# EAGLE design mapleCUx_large_330-014 (EAGLE 7.7.0)
MAPLE-CUx Large Version
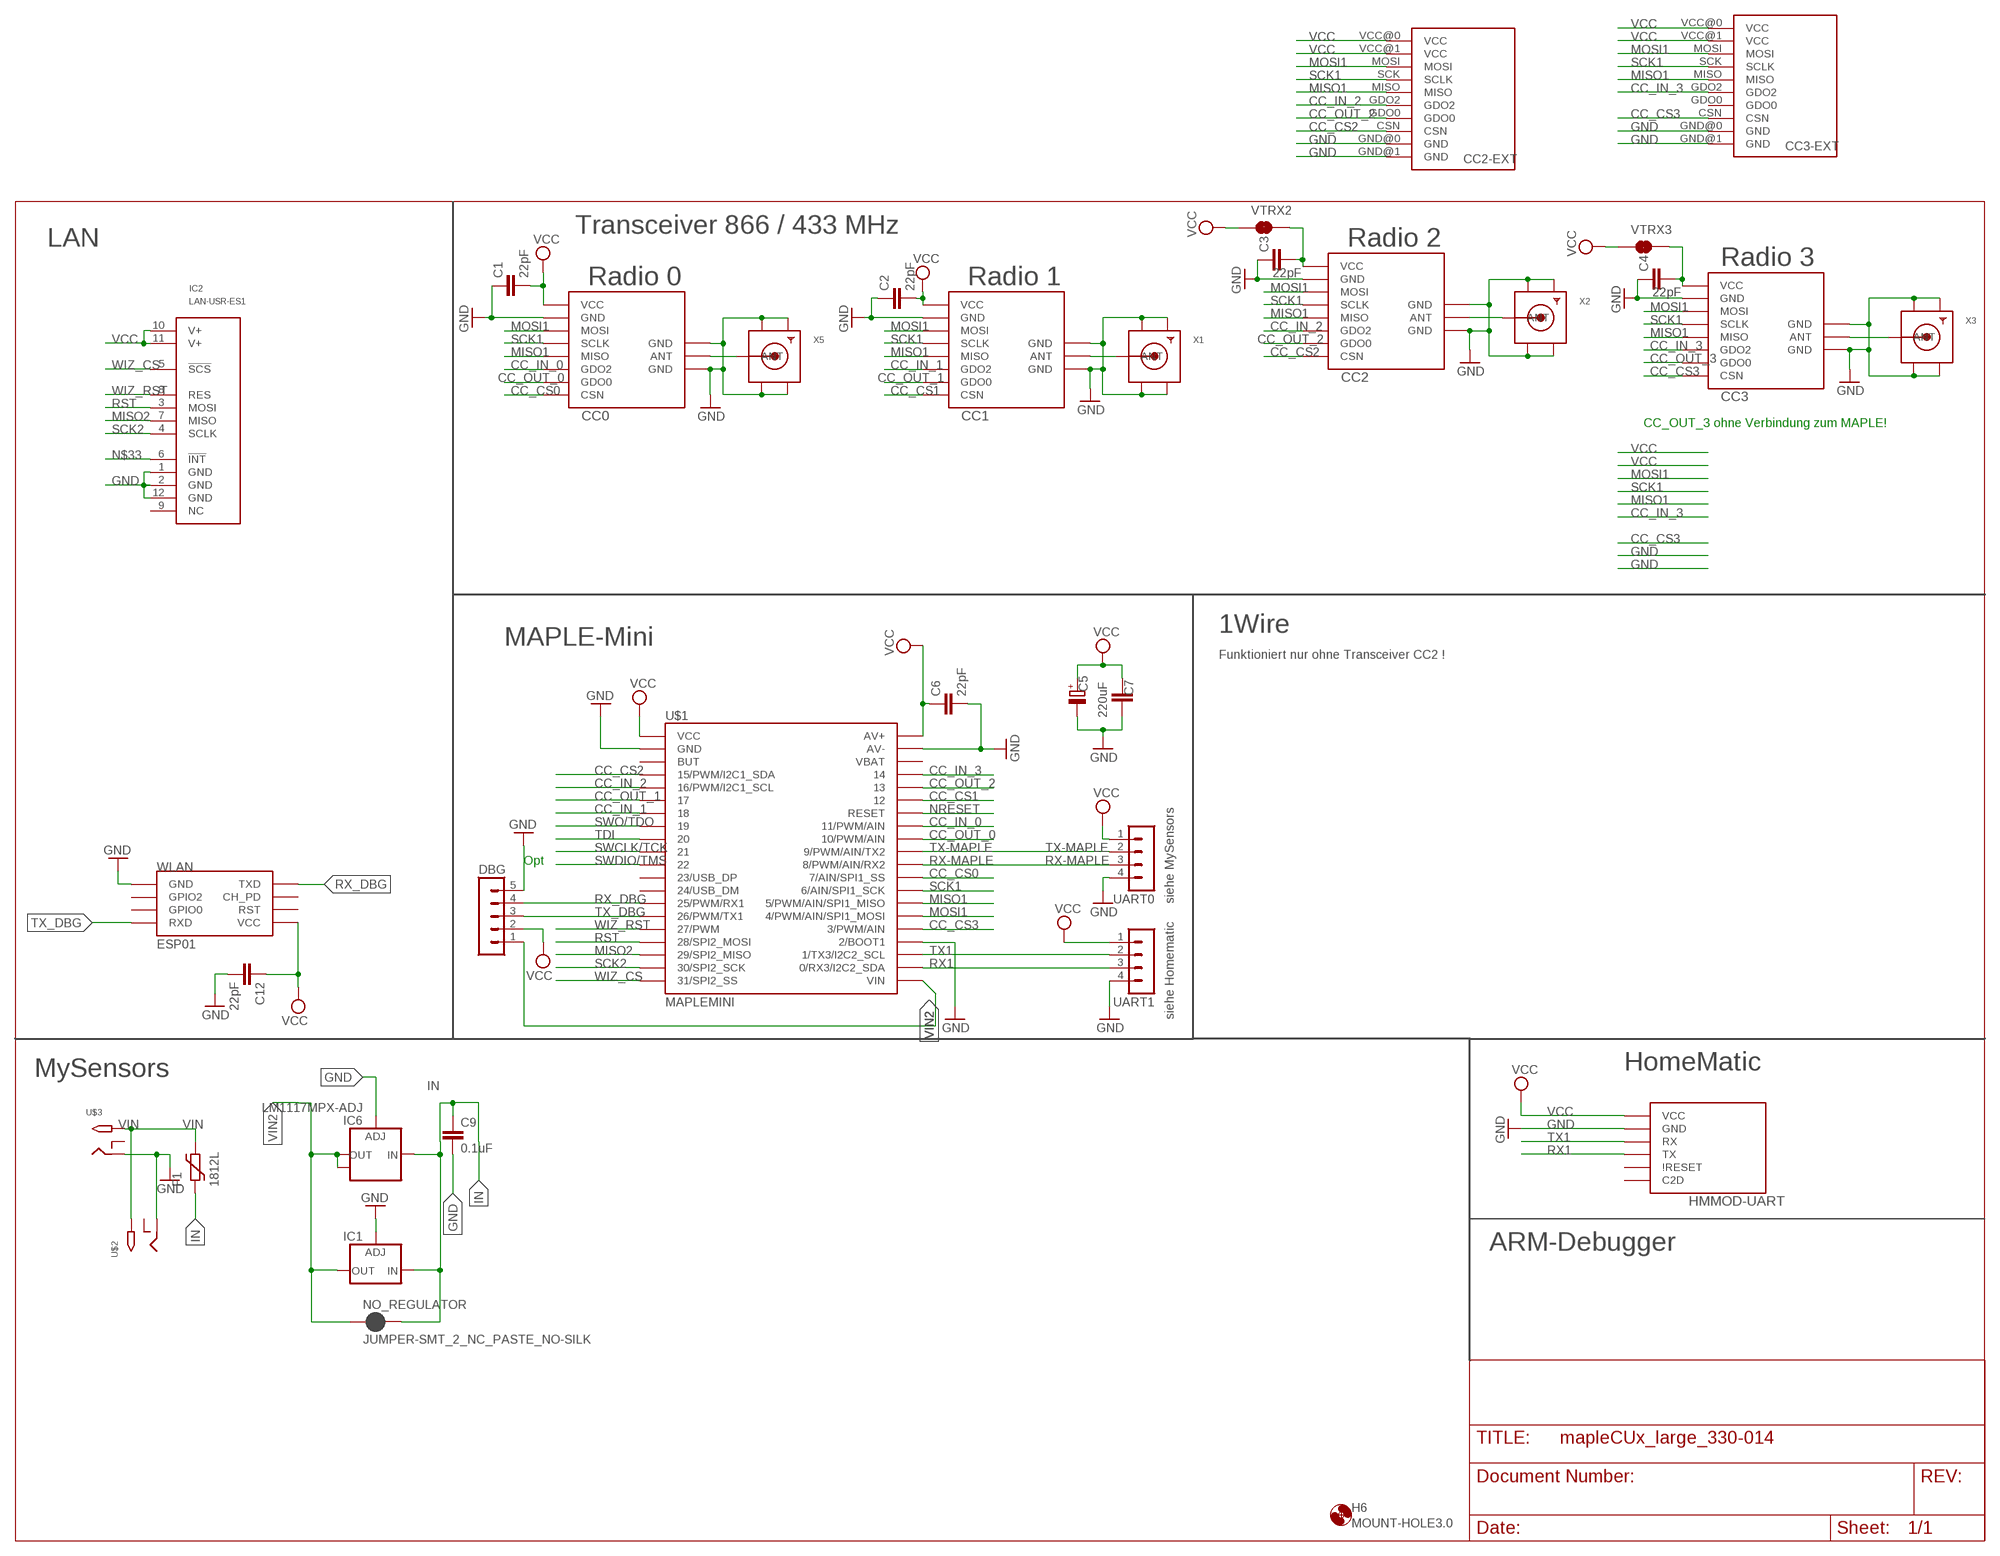
[diagram p0: schematic, sheet 1]

## Parts
C1  22pF  C-EUC0805  [C0805]
C2  22pF  C-EUC0805  [C0805]
C3  22pF  C-EUC0805  [C0805]
C4  22pF  C-EUC0805  [C0805]
C5  220uF  CPOL-EUE5-8.5  [E5-8,5]
C6  22pF  C-EUC0805  [C0805]
C7  C-EUC1812  [C1812]
C9  0.1uF  C-EUC1206  [C1206]
C12  22pF  C-EUC0805  [C0805]
CC0  CC1101  CC1101_MODULE1SMD  [CC1101_MODULE1_SMD]
CC1  CC1101_MODULE1SMD  [CC1101_MODULE1_SMD]
CC2  CC1101_MODULE1SMD  [CC1101_MODULE1_SMD]
CC2-EXT  CC1101_MODULE3_DIL  [CC1101_MODULE3_DIL]
CC3  CC1101_MODULE1SMD  [CC1101_MODULE1_SMD]
CC3-EXT  CC1101_MODULE3_DIL  [CC1101_MODULE3_DIL]
DBG  MA05-1  [MA05-1]
F1  1812L  [1812L]
H6  MOUNT-HOLE3.0  [3,0]
HMMOD-UART  HM-MOD-UARTDIL  [HM-MOD-UART-DIL]
IC1  LD117ADT50TR  [DPACK]
IC2  LAN-USR-ES1  [USR-ES1]
IC6  LM1117MPX-ADJ  [SOT223]
NO_REGULATOR  JUMPER-SMT_2_NC_PASTE_NO-SILK  [SMT-JUMPER_2_NC_PASTE_NO-SILK]
U$1  MAPLEMINI  [20-DIP]
U$2  2.1MMJACKTHM  [PJ-102A]
U$3  2.1MMJACKTHM  [PJ-102A]
UART0  MA04-1  [MA04-1]
UART1  MA04-1  [MA04-1]
VTRX2  JUMPER-SMT_2_NC_TRACE_SILK  [SMT-JUMPER_2_NC_TRACE_SILK]
VTRX3  JUMPER-SMT_2_NC_TRACE_SILK  [SMT-JUMPER_2_NC_TRACE_SILK]
WLAN  ESP01  [ESP01]
X1  SMACONNECTOR_EDGE  [SMA_EDGELAUNCH]
X2  SMACONNECTOR_EDGE  [SMA_EDGELAUNCH]
X3  SMACONNECTOR_EDGE  [SMA_EDGELAUNCH]
X5  SMACONNECTOR_EDGE  [SMA_EDGELAUNCH]

## Nets
ANT0: CC0.ANT X5.P(ANT)
ANT1: CC1.ANT X1.P(ANT)
ANT2: CC2.ANT X2.P(ANT)
ANT3: CC3.ANT X3.P(ANT)
CC_CS0: CC0.CSN U$1.29(7/AIN/SPI1_SS)
CC_CS1: CC1.CSN U$1.35
CC_CS2: CC2-EXT.CSN CC2.CSN U$1.4(15/PWM/I2C1_SDA)
CC_CS3: CC3-EXT.CSN CC3.CSN U$1.25(3/PWM/AIN)
CC_IN_0: CC0.GDO2 U$1.33(11/PWM/AIN)
CC_IN_1: CC1.GDO2 U$1.7
CC_IN_2: CC2-EXT.GDO2 CC2.GDO2 U$1.5(16/PWM/I2C1_SCL)
CC_IN_3: CC3-EXT.GDO2 CC3.GDO2 U$1.37
CC_OUT_0: CC0.GDO0 U$1.32(10/PWM/AIN)
CC_OUT_1: CC1.GDO0 U$1.6
CC_OUT_2: CC2-EXT.GDO0 CC2.GDO0 U$1.36
CC_OUT_3: CC3.GDO0
GND [Power]: C1.1 C2.1 C3.1 C4.1 C5.- C6.2 C7.1 C9.2 C12.2 CC0.GND@0(GND) CC0.GND@1(GND) CC0.GND@2(GND) CC1.GND@0(GND) CC1.GND@1(GND) CC1.GND@2(GND) CC2-EXT.GND@0(GND) CC2-EXT.GND@1(GND) CC2.GND@0(GND) CC2.GND@1(GND) CC2.GND@2(GND) CC3-EXT.GND@0(GND) CC3-EXT.GND@1(GND) CC3.GND@0(GND) CC3.GND@1(GND) CC3.GND@2(GND) DBG.5 HMMOD-UART.2(GND) IC1.1(ADJ) IC2.1(GND) IC2.2(GND) IC2.12(GND) IC6.1(ADJ) U$1.2(GND) U$1.24(2/BOOT1) U$1.39(AV-) U$2.RING U$3.RING UART0.4 UART1.4 WLAN.GND X1.GND@1(GND4) X1.GND@2(GND3) X1.GND@3(GND2) X1.GND@4(GND1) X2.GND@1(GND4) X2.GND@2(GND3) X2.GND@3(GND2) X2.GND@4(GND1) X3.GND@1(GND4) X3.GND@2(GND3) X3.GND@3(GND2) X3.GND@4(GND1) X5.GND@1(GND4) X5.GND@2(GND3) X5.GND@3(GND2) X5.GND@4(GND1)
IN [Power]: C9.1 F1.P$1 IC1.3(IN) IC6.3(IN) NO_REGULATOR.2
MISO1: CC0.MISO CC1.MISO CC2-EXT.MISO CC2.MISO CC3-EXT.MISO CC3.MISO U$1.27(5/PWM/AIN/SPI1_MISO)
MISO2: IC2.7(MISO) U$1.18(29/SPI2_MISO)
MOSI1: CC0.MOSI CC1.MOSI CC2-EXT.MOSI CC2.MOSI CC3-EXT.MOSI CC3.MOSI U$1.26(4/PWM/AIN/SPI1_MOSI)
N$1 [Power]: C3.2 CC2.VCC VTRX2.2
N$3 [Power]: C4.2 CC3.VCC VTRX3.2
N$33: IC2.6(!INT!)
NRESET: U$1.34(RESET)
RST: IC2.3(MOSI) U$1.17(28/SPI2_MOSI)
RX1: HMMOD-UART.5(TX) U$1.22(0/RX3/I2C2_SDA) UART1.3
RX-MAPLE: U$1.30(8/PWM/AIN/RX2) UART0.3
RX_DBG: DBG.4 U$1.14(25/PWM/RX1) WLAN.TX(TXD)
SCK1: CC0.SCLK CC1.SCLK CC2-EXT.SCK(SCLK) CC2.SCLK CC3-EXT.SCK(SCLK) CC3.SCLK U$1.28(6/AIN/SPI1_SCK)
SCK2: IC2.4(SCLK) U$1.19(30/SPI2_SCK)
SWCLK/TCK: U$1.10
SWDIO/TMS: U$1.11
SWO/TDO: U$1.8
TDI: U$1.9
TX1: HMMOD-UART.6(RX) U$1.23(1/TX3/I2C2_SCL) UART1.2
TX-MAPLE: U$1.31(9/PWM/AIN/TX2) UART0.2
TX_DBG: DBG.3 U$1.15(26/PWM/TX1) WLAN.RX(RXD)
VCC [Power]: C1.2 C2.2 C5.+ C6.1 C7.2 C12.1 CC0.VCC CC1.VCC CC2-EXT.VCC@0(VCC) CC2-EXT.VCC@1(VCC) CC3-EXT.VCC@0(VCC) CC3-EXT.VCC@1(VCC) DBG.2 HMMOD-UART.1(VCC) IC2.10(V+) IC2.11(V+) U$1.1(VCC) U$1.40(AV+) UART0.1 UART1.1 VTRX2.1 VTRX3.1 WLAN.VCC
VIN [Power]: F1.P$2 U$2.TIP U$3.TIP
VIN2 [Power]: DBG.1 IC1.4(OUT) IC6.2(OUT) IC6.TAB(OUT1) NO_REGULATOR.1 U$1.21(VIN)
WIZ_CS: IC2.5(!SCS!) U$1.20(31/SPI2_SS)
WIZ_RST: IC2.8(RES) U$1.16(27/PWM)
Unconnected: CC3-EXT.GDO0 HMMOD-UART.3(C2D) HMMOD-UART.4(\!RESET) IC2.9(NC) U$1.3(BUT) U$1.12(23/USB_DP) U$1.13(24/USB_DM) U$1.38(VBAT) U$2.RING_SW U$3.RING_SW WLAN.CH_PD WLAN.GPIO0 WLAN.GPIO2 WLAN.RST

## Notes on the sheet
- Transceiver 866 / 433 MHz
- LAN | Radio 2
- Radio 3
- Radio 0 | Radio 1
- CC_OUT_3 ohne Verbindung zum MAPLE!
- 1Wire
- MAPLE-Mini
- Funktioniert nur ohne Transceiver CC2 !
- Opt
- siehe MySensors
- siehe Homematic
- MySensors | HomeMatic
- ARM-Debugger

## Library data of the parts
C1-C4 C6 C7 C9 C12 = rcl:C-EU: CAPACITOR, European symbol
C5 = rcl:CPOL-EU: POLARIZED CAPACITOR, European symbol
CC0 CC1-CC3 = wireless:CC1101_MODULE1: CC1101 wireless module for 433/868 MHz (sold from Aliexpress). DIL version for mounting with pin header (and SMD soldering) and SMD only variant available.
CC2-EXT CC3-EXT = wireless:CC1101_MODULE3_DIL: 433 Mhz CC1101 wireless module named RF1101SE V3.1 package special has only limited silk screen on tPlace layer
DBG = con-lstb:MA05-1: PIN HEADER; OC_FARNELL: unknown; OC_NEWARK: unknown
F1 = ptc-littlefuse:1812L
H6 = holes:MOUNT-HOLE: MOUNTING HOLE with drill center marker
HMMOD-UART = wireless:HM-MOD-UART: eQ3 HM-MOD-UART-AW-SH2 wireless module for 868 MHz. DIL version for mounting with pin header (antenna upwards) and SMD variant available (antenna downwards).
IC1 = v-reg:LD117A?*: Low drop fixed and adjustable positive voltage regulators 1 A Source: http://www.st.com/stonline/products/literature/ds/7194/ld1117axx.pdf
IC2 = Martin-Communication:LAN-USR-ES1
IC6 = lm1117:LM1117MPX-ADJ
NO_REGULATOR = SparkFun-Jumpers:JUMPER-SMT_2_NC_PASTE: Normally closed solder jumper This jumper has an aperture in the stencil to allow solder paste to bridge the split in the wire so it's normally closed (NC). Wick off the solder to open the connection. Reapply solder to reclose the connection.
U$1 = maplemini-small:MAPLEMINI
U$2 U$3 = adafruit:2.1MMJACK: 2.1mm x 5.5mm THM DC jack with internal switch. Digikey part #PJ-102A, 4UCON part #05537 2.1mm x 5.5mm SMT DC jack with internal switch. Digikey part #PJ-002A-SMT, 4UCON part #03267 By microbuilder.eu & adafruit.com
UART0 UART1 = con-lstb:MA04-1: PIN HEADER; OC_FARNELL: unknown; OC_NEWARK: unknown
VTRX2 VTRX3 = SparkFun-Jumpers:JUMPER-SMT_2_NC_TRACE: Normally closed trace jumper This jumper has a trace between two pads so it's normally closed (NC). Use a razor knife to open the connection. For best results follow the IPC guidelines for cutting traces: Cutout at least 0.063 mm (0.005 in). Remove all loose material to clean up the cut area. Seal the cut with an approved epoxy. Reapply solder to reclose the connection.
WLAN = esp8266modules:ESP01: ESP8266 Wifi module 01
X1-X3 X5 = adafruit:SMACONNECTOR: SMA Connector 90° DIP SMA Connector, 50 Ohm (4UConnector: 07259)

## Net classes
0 default: width 0.305 mm
1 Power: width 0.61 mm

## Board
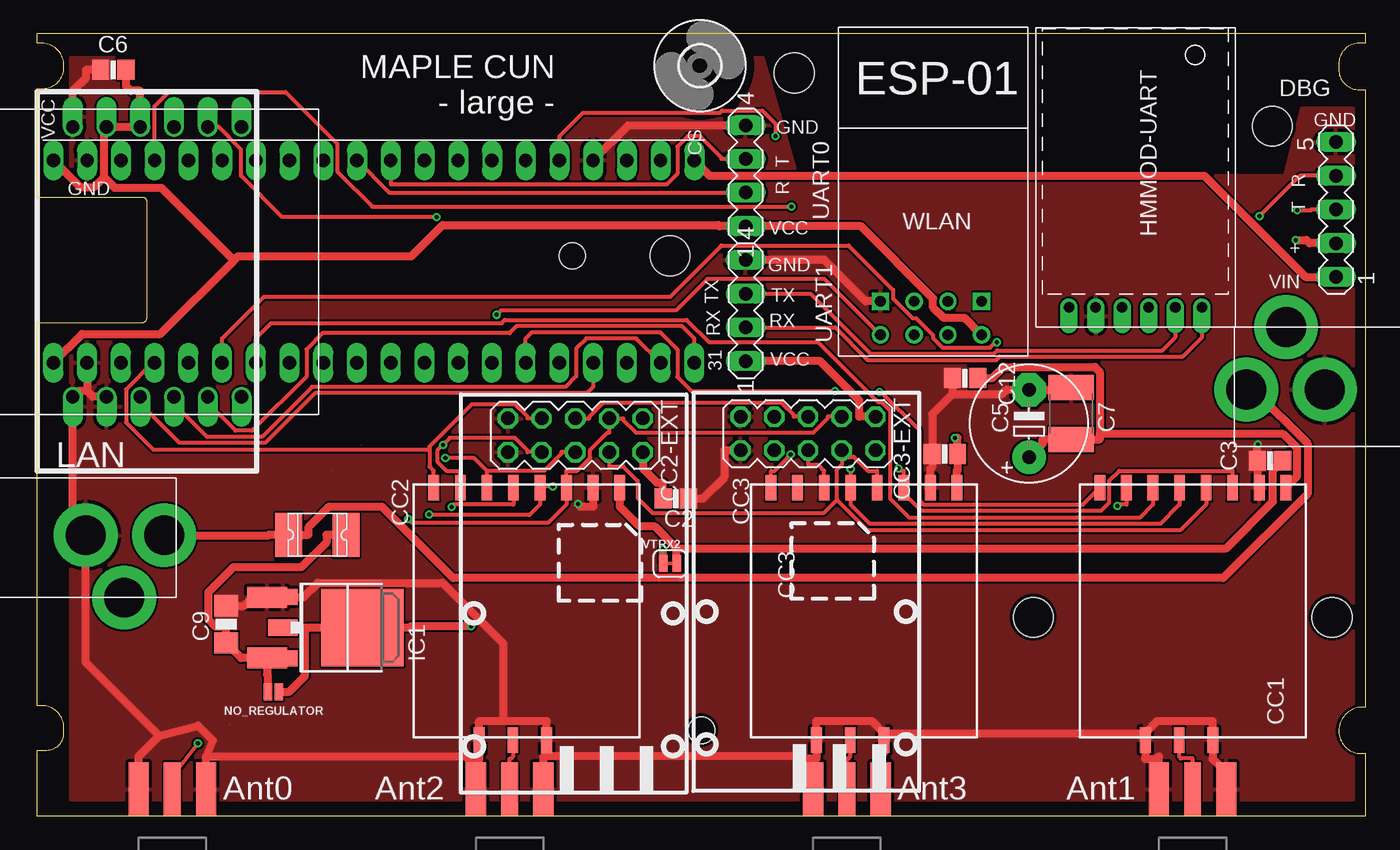
[diagram p1: board, top side]
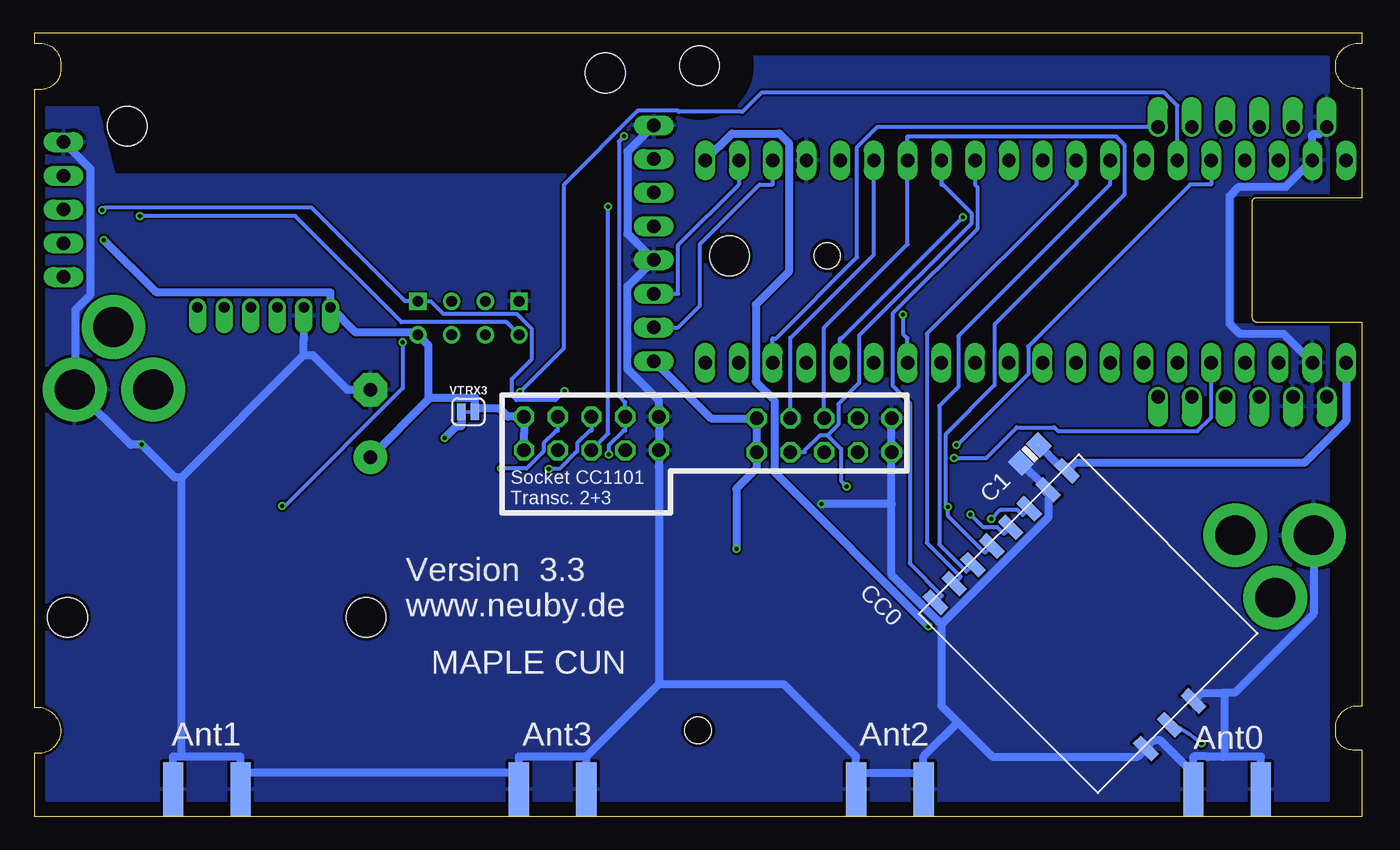
[diagram p2: board, bottom side, seen from below]

Size 100 x 59 mm. Coordinates in mm from the lower left corner, seen from the top.
Outline: 0,0 0,5 0.71,5 arc90 2,6.29 2,6.67 arc90 0.32,8.35 0,8.35 0,37.21 7.89,37.21 arc90 8.26,37.58 8.26,46.32 arc90 7.97,46.61 0,46.61 0,54.83 0.39,54.83 arc90 2,56.44 2,56.57 arc90 0.33,58.24 0,58.24 0,59 100,59 100,58.24 99.54,58.24 arc90 98,56.7 98,56.41 arc90 99.41,54.75 100,54.75 100,8.24 99.8,8.24 arc90 98,6.44 arc90 99.69,4.75 100,4.75 100,0 0,0
Copper layers (1*16): Top 0.035mm / dielectric 1.5mm / Bottom 0.035mm
Design rules "SeeedStudio_2layer_DRU_no_angle_20140221": minimum track width 6mil, minimum drill 12mil, track to track 6mil, track to pad 6mil, pad to pad 6mil, via to via 6mil, smd to smd 0mil, copper to edge 10mil, drill to drill 10mil, minimum pad ring 10mil, minimum via ring 6mil, stop-mask expansion 2mil, vias tented up to drill 100mil, thermal gap 10mil
Holes 2 mm at 50,6.5 40.28,42.23
Holes 3 mm at 47.65,42.23 93,52 57,56 75,15 97.5,15
tRestrict: area 0,37.3 to 9.4,46.5
bRestrict: area 0,37.3 to 9.4,46.5

### Footprints (pad centres in the part's own frame; a part is rotated, then mirrored left to right if it is on the bottom)
C0805 = smd 1.3 x 1.5: 1 -0.95,0; 2 0.95,0
E5-8,5 = drill 1.016 pad 2.54: + -2.54,0 | drill 1.016 pad 2.54 octagon: - 2.54,0
C1812 = smd 1.9 x 3.4: 1 -1.95,0; 2 1.95,0
C1206 = smd 1.6 x 1.8: 1 -1.4,0; 2 1.4,0
CC1101_MODULE1_SMD = smd 1.93 x 0.813: ANT 19,5.96; CSN 0,0; GDO0 0,2; GDO2 0,4; GND@0 0,12; GND@1 19,8.5; GND@2 19,3.42; MISO 0,6; MOSI 0,10; SCLK 0,8; VCC 0,14
CC1101_MODULE3_DIL = drill 1.016 octagon: CSN 1.81,6.1; GDO0 4.35,6.1; GDO2 4.35,8.64; GND@0 1.81,3.56; GND@1 4.35,3.56; MISO 1.81,8.64; MOSI 1.81,11.18; SCK 4.35,11.18; VCC@0 1.81,13.72; VCC@1 4.35,13.72
MA05-1 = drill 1.016 long: 1 -5.08,0; 2 -2.54,0; 3 0,0; 4 2.54,0; 5 5.08,0
1812L = smd 2.03 x 3.3: P$1 -2.16,0; P$2 2.16,0
3,0 = hole 3: 0,0
HM-MOD-UART-DIL = drill 0.8 offset: 1 0,12; 2 0,10; 3 0,8; 4 0,6; 5 0,4; 6 0,2
DPACK = smd 1.6 x 3: 1 -2.28,-4.8; 3 2.28,-4.8 | smd 5.8 x 6.2: 4 0,2.38
USR-ES1 = drill 1 pad 1.35 offset: 1 -10.16,5.715; 2 -10.16,3.175; 3 -10.16,0.635; 4 -10.16,-1.905; 5 -10.16,-4.445; 6 -10.16,-6.985; 7 10.16,-6.985; 8 10.16,-4.445; 9 10.16,-1.905; 10 10.16,0.635; 11 10.16,3.175; 12 10.16,5.715
SOT223 = smd 1.219 x 2.235: 1 -2.311,-3.099; 2 0,-3.099; 3 2.311,-3.099 | smd 3.6 x 2.2: TAB 0,3.099
SMT-JUMPER_2_NC_PASTE_NO-SILK = smd 0.635 x 1.27: 1 -0.406,0; 2 0.406,0
20-DIP = drill 1.016 pad 1.27 long: 1 -24.13,-7.62; 2 -21.59,-7.62; 3 -19.05,-7.62; 4 -16.51,-7.62; 5 -13.97,-7.62; 6 -11.43,-7.62; 7 -8.89,-7.62; 8 -6.35,-7.62; 9 -3.81,-7.62; 10 -1.27,-7.62; 11 1.27,-7.62; 12 3.81,-7.62; 13 6.35,-7.62; 14 8.89,-7.62; 15 11.43,-7.62; 16 13.97,-7.62; 17 16.51,-7.62; 18 19.05,-7.62; 19 21.59,-7.62; 20 24.13,-7.62 | drill 1 pad 1.27 long: 21 24.13,7.62; 22 21.59,7.62; 23 19.05,7.62; 24 16.51,7.62; 25 13.97,7.62; 26 11.43,7.62; 27 8.89,7.62; 28 6.35,7.62; 29 3.81,7.62; 30 1.27,7.62; 31 -1.27,7.62; 32 -3.81,7.62; 33 -6.35,7.62; 34 -8.89,7.62; 35 -11.43,7.62; 36 -13.97,7.62; 37 -16.51,7.62; 38 -19.05,7.62; 39 -21.59,7.62; 40 -24.13,7.62
PJ-102A = drill 3 pad 4.8: RING 0.1,-3.39; RING_SW -4.6,-6.29; TIP 0.1,-9.29
MA04-1 = drill 1.016 long: 1 -3.81,0; 2 -1.27,0; 3 1.27,0; 4 3.81,0
SMT-JUMPER_2_NC_TRACE_SILK = smd 0.635 x 1.27: 1 -0.508,0; 2 0.508,0
ESP01 = drill 0.8: CH_PD -1.285,-8.178; GPIO0 1.255,-5.638; GPIO2 -1.285,-5.638; RST 1.255,-8.178; TX -3.825,-8.178; VCC 3.795,-8.178 | drill 0.8 square: GND -3.825,-5.638; RX 3.795,-5.638
SMA_EDGELAUNCH = smd 4.064 x 1.524: GND@1 2.032,-2.54; GND@2 2.032,2.54 | smd 4.064 x 1.524 bottom: GND@3 2.032,2.54; GND@4 2.032,-2.54 | smd 4.064 x 1.27: P 2.032,0

### Placement (x,y rotation side)
C1  25.02,27.3 45 bottom
C2  48.08,23.95 180 top
C3  92.82,26.8 0 top
C4  68.33,27.3 0 top
C5  74.68,29.59 90 top
C6  5.71,56.24 180 top
C7  77.85,30.35 270 top
C9  14.22,14.48 90 top
C12  69.85,33.02 180 top
CC0  32.13,16.13 315 bottom
CC1  80.01,24.77 270 top
CC2  29.84,24.77 270 top
CC2-EXT  31.87,31.79 270 top
CC3  55.24,24.77 270 top
CC3-EXT  49.4,31.93 270 top
DBG  97.79,45.72 90 top
F1  21.08,21.21 180 top
H6  49.89,56.55 0 top
HMMOD-UART  89.69,38.35 90 top
IC1  22.1,14.22 270 top
IC2  8.38,41.78 90 top
IC6  21.59,14.22 270 top
NO_REGULATOR  17.78,9.4 180 top
U$1  25.34,41.8 0 top
U$2  0.25,21.08 90 top
U$3  100.33,32.26 270 top
UART0  53.34,48.26 90 top
UART1  53.34,38.1 90 top
VTRX2  47.62,19.05 0 top
VTRX3  67.31,30.48 180 bottom
WLAN  67.31,44.45 0 top
X1  87,0 90 top
X2  35.56,0 90 top
X3  60.96,0 90 top
X5  10.16,0 90 top

### Tracks (layer width: path | path; a pad name or v marks a point on that pad's centre or on a via)
ANT0  (via drill 0.3 pad 0.61)  (1 unrouted)
  Top 0.305: X5.P 10.16,3.35 10.45,3.35 v12.09,5.5
  Bottom 0.305: CC0.ANT 13.72,6.65 13.08,6.26 v12.09,5.5
ANT1
  Top 0.305: X1.P 87,4.37 86.1,4.37 85.97,4.5 CC1.ANT
ANT2
  Top 0.305: X2.P 35.56,4.37 35.68,4.37 35.8,4.5 CC2.ANT
ANT3
  Top 0.305: X3.P 60.96,4.37 61.08,4.37 61.2,4.5 CC3.ANT
CC_CS0
  Bottom 0.305: U$1.29 29.15,47.61 28.97,47.43 28.97,44.25 35.36,37.86 35.36,32.45 34.06,31.15 34.06,19.07 31.63,16.63 CC0.CSN
CC_CS1  (via drill 0.3 pad 0.61)
  Top 0.305: v63.41,31.98 63.53,31.98 66.41,29.09 66.41,23.8 66.71,23.5 78.74,23.5 CC1.CSN
  Bottom 0.305: U$1.35 13.91,53.54 14.9,54.54 45.21,54.54 46.67,53.07 51.46,53.07 51.53,53.15 54.55,53.15 60.12,47.57 60.12,35.26 v63.41,31.98
CC_CS2
  Top 0.305: 29.52,27.63 29.52,27.87 32.7,31.05 35.97,31.05 36.9,30.11 36.9,29.98 CC2-EXT.CSN | CC2.CSN 29.84,26.04 29.52,26.36 29.52,27.63 | U$1.4 8.69,34.18 6.68,32.17 6.68,29.68 8.73,27.63 29.52,27.63
CC_CS3  (via drill 0.3 pad 0.61)
  Top 0.305: U$1.25 39.31,51.23 41.09,53.01 51.4,53.01 51.56,53.17 54.6,53.17 55.57,52.2 v55.57,51.24 | CC3.CSN 55.24,26.04 55.51,26.04 v56.73,27.25
  Bottom 0.305: v56.73,27.25 56.73,27.95 55.63,29.05 55.49,29.05 CC3-EXT.CSN 55.49,31.18 55.97,31.66 55.97,50.84 v55.57,51.24
CC_IN_0  (1 unrouted)
  Bottom 0.305: CC0.GDO2 29.8,18.45 31.84,20.49 31.84,30.92 30.42,32.35 30.42,36.18 18.99,47.61 U$1.33
CC_IN_1
  Top 0.305: CC1.GDO2 84.01,23.5 83.04,22.53 65.62,22.53 64.2,23.95 64.2,30.57 63.55,31.22 63.28,31.22 58.78,35.72 50.58,35.72 48.9,37.4 35.19,37.4 34.96,37.16 17.6,37.16 16.45,36.01 U$1.7
CC_IN_2  (via drill 0.3 pad 0.61)
  Top 0.305: 33.84,26.04 32.88,27 v30.72,27 | CC2-EXT.GDO2 39.44,27.44 39.44,27.31 38.17,26.04 33.84,26.04 | CC2.GDO2 33.84,26.04
  Bottom 0.305: v30.72,27 28.3,27 26,29.3 23.18,29.3 22.9,29.02 12.41,29.02 11.37,30.06 U$1.5
CC_IN_3  (via drill 0.3 pad 0.61)
  Top 0.305: CC3-EXT.GDO2 58.03,26.51 58.77,26.51 59.24,26.04 CC3.GDO2 | U$1.37 8.83,53.49 9.9,54.56 18.69,54.56 22.59,50.67 22.59,48.58 25.24,45.92 v56.77,45.92
  Bottom 0.305: CC3-EXT.GDO2 56.77,28.84 v56.77,45.92
CC_OUT_0  (1 unrouted)
  Bottom 0.305: CC0.GDO0 30.21,18.05 32.77,20.61 32.77,36.36 21.53,47.61 U$1.32
CC_OUT_1  (via drill 0.3 pad 0.61)
  Top 0.305: v81.33,23.39 81.43,23.5 82.01,23.5 CC1.GDO0 | U$1.6 13.91,36.01 17.06,39.16 47.67,39.16 51.51,43 61.09,43 64.44,39.65 64.44,39 65.91,37.54 66.18,37.54 67.45,36.26 67.45,36.02 68.16,35.31 71.74,35.31 72.14,35.72 v72.25,35.72
  Bottom 0.305: v72.25,35.72 72.25,32.26 81.12,23.39 v81.33,23.39
CC_OUT_2  (via drill 0.3 pad 0.61)
  Top 0.305: CC2-EXT.GDO0 36.9,27.44 36.9,27.57 35.96,28.52 31.07,28.52 v30.55,27.99 30.11,27.55 30.11,26.75 30.82,26.04 31.84,26.04 CC2.GDO0
  Bottom 0.305: U$1.36 11.37,47.61 12.94,47.61 25.13,35.41 25.13,33.32 30.46,27.99 v30.55,27.99
GND  (via drill 0.3 pad 0.61)
  Top 0.61: v91.91,28 91.87,28 C3.1 91.87,25.59 92.01,25.45 CC1.GND@0 | CC2.GND@0 41.84,23.34 40.89,23.34 v40.71,23.52 | 63.74,6.27 83.43,6.27 | X3.GND@4 63.5,4.52 63.74,4.77 CC3.GND@1 63.74,6.27 | 33.02,4.34 33.27,4.34 CC2.GND@2 33.27,7.19 35.08,7.19 | X2.GND@3 33.02,4.34 | 12.7,4.52 32.25,4.52 32.43,4.34 33.02,4.34 | 9.17,6.07 12.1,6.83 13.21,5.72 12.7,4.52 | X5.GND@4 12.7,4.52 | 3.75,32.04 3.08,32.04 IC2.1 2.67,22.16 U$2.RING 3.64,11.6 9.17,6.07 | IC2.2 4.16,31.62 3.75,32.04 | 3.75,32.04 3.75,32.2 U$1.2 | X5.GND@3 7.62,4.52 9.17,6.07 | CC3.GND@0 67.25,26.19 67.38,26.33 C4.1 67.38,30.3 68.9,31.81 | X1.GND@3 84.45,4.52 84.28,4.34 83.43,4.34 CC1.GND@2 83.43,6.27 | 83.43,6.27 84.34,7.19 88.51,7.19 CC1.GND@1 88.51,4.34 89.53,3.32 X1.GND@4 | 58.42,4.34 57.6,4.34 57.42,4.52 38.34,4.52 | 58.42,4.34 58.66,4.34 CC3.GND@2 58.66,7.19 62.83,7.19 63.74,6.27 | X3.GND@3 58.42,4.34 | 38.34,4.52 38.1,4.52 X2.GND@1 | 38.34,4.52 CC2.GND@1 38.34,7.19 | 35.08,7.19 38.34,7.19 | 38.34,7.19 | 35.08,7.19 | 35.08,7.19 35.08,13.02 30.5,17.6 21.13,17.6 20.07,16.54 IC6.1 17.33,16.54 IC1.1 16.21,16.5 15.58,15.88 C9.2 | C2.1 50.13,23.95 51.74,25.55 51.74,27.57 CC3-EXT.GND@1 | WLAN.GND 62.37,38.81 59.28,41.91 UART1.4 | C6.2 3.66,56.24 3.66,55.65 2.67,54.66 IC2.12 | 68.9,31.81 72.63,31.81 72.95,32.13 C5.- 76.4,32.13 76.58,32.3 C7.1 | C12.2 68.9,31.81 | U$1.24 44.5,52.07 UART0.4
  Bottom 0.61: 33.02,3.28 33.02,4.52 30.44,7.1 | X2.GND@3 33.02,3.28 | 38.1,3.28 38.1,4.52 43.56,9.99 52.95,9.99 | X2.GND@1 38.1,3.28 | 38.1,3.28 33.02,3.28 | 52.95,9.99 58.42,4.52 | 52.95,9.99 52.95,26.36 CC3-EXT.GND@1 CC3-EXT.GND@0 52.95,31.33 55.34,33.72 55.34,39.91 UART1.4 55.33,43.9 55.33,50.08 UART0.4 | 30.44,7.1 27.84,4.5 16.89,4.5 CC0.GND@2 15.67,5.72 15.19,5.72 12.7,3.24 | 31.68,14.46 31.68,8.35 30.44,7.1 | U$1.2 5.91,36.34 9.2,36.34 9.96,37.11 9.96,46.73 9.27,47.43 5.74,47.43 U$1.39 3.75,51.38 3.23,51.38 IC2.12 | 88.91,25.54 89.44,25.54 v91.91,28 92.74,28 96.9,32.16 | 88.91,25.54 79.69,34.75 | 88.91,4.52 88.91,25.54 | 96.9,32.16 U$3.RING | DBG.5 95.78,48.79 95.78,39.28 96.9,38.16 96.9,32.16 | 88.91,4.52 84.45,4.52 84.45,3.28 | 88.91,4.52 89.53,4.52 X1.GND@4 | 63.5,3.28 63.5,4.52 58.42,4.52 | X3.GND@4 63.5,3.28 | X1.GND@3 84.45,3.28 | 63.5,3.28 84.45,3.28 | 35.43,23.52 CC2-EXT.GND@1 CC2-EXT.GND@0 | 31.68,14.46 35.43,18.21 35.43,23.52 | 35.43,23.52 v40.71,23.52 | 23.83,24.43 23.63,24.23 23.63,22.51 31.68,14.46 | X3.GND@3 58.42,4.52 | 10.39,4.55 10.46,4.48 11.64,4.48 11.68,4.52 12.7,4.52 12.7,3.24 | 23.83,24.43 23.83,24.77 C1.1 | CC0.GND@0 23.83,24.43 | X5.GND@4 12.7,3.24 | 79.69,34.75 79.02,34.75 76.4,32.13 C5.- | 79.69,34.75 79.69,35.94 HMMOD-UART.2 | 10.39,4.55 10.36,4.52 7.62,4.52 X5.GND@3 | 10.39,9.31 10.39,4.55 | CC0.GND@1 12.07,9.31 10.39,9.31 | U$2.RING 3.64,15.27 9.6,9.31 10.39,9.31
  pour Top: 2.54,57.15 54.61,57.15 57.15,48.26 93.98,48.26 95.25,53.34 99.06,53.34 99.06,1.27 2.54,1.27
  pour Bottom: 2.54,1.27 2.54,57.15 54.61,57.15 57.15,48.26 93.98,48.26 95.25,53.34 99.06,53.34 99.06,1.27
IN
  Top 0.61: F1.P$1 21.77,21.21 21.77,20.66 19.88,18.76 14.75,18.76 12.87,16.88 12.87,14.83 13.36,14.34 14.22,14.34 C9.1 15.34,11.96 15.34,11.94 IC1.3 | IC1.3 17.3,10.69 17.37,10.61 NO_REGULATOR.2 | IC6.3 18.46,11.94 IC1.3
MISO1  (via drill 0.3 pad 0.61)  (1 unrouted)
  Top 0.305: v31.18,23.31 31.36,23.5 35.84,23.5 CC2.MISO | CC3-EXT.MISO 56.97,30.11 56.97,30.23 56.01,31.19 42.65,31.19 41.58,30.11 41.58,29.98 CC2-EXT.MISO | v61.24,26.19 CC3.MISO 61.24,23.5 62.67,22.07 84.59,22.07 86.01,23.5 CC1.MISO
  Bottom 0.305: CC2-EXT.MISO 40.51,36.82 34.23,43.11 U$1.27 34.23,51.23 18.54,51.23 17.91,50.6 17.91,46.82 27.67,37.06 27.67,32.48 31.37,28.79 31.37,23.5 v31.18,23.31 31.18,22.66 28.39,19.87 CC0.MISO | CC3-EXT.MISO 58.03,29.05 58.17,29.05 59.1,28.11 59.1,27.52 60.44,26.19 v61.24,26.19 | v61.24,26.19
MISO2
  Bottom 0.305: U$1.18 44.39,36.01 44.14,36.01 38.04,42.12 38.04,50.42 36.51,51.94 IC2.7
MOSI1  (via drill 0.3 pad 0.61)  (1 unrouted)
  Top 0.305: CC1.MOSI 90.01,26.04 81.47,26.04 80.72,25.29 80.72,23.65 80.11,23.04 66.52,23.04 65.25,24.32 CC3.MOSI 65.25,25.4 65.25,26.04 65.02,26.04 v64.84,26.21 | v27.93,22.42 28.22,22.14 38.49,22.14 39.84,23.5 CC2.MOSI 39.84,26.04 40.64,26.04 41.62,27.02 41.62,27.59 42.94,28.91 43.05,28.91 CC2-EXT.MOSI 44.12,29.98 44.12,29.87 45.1,28.89 58.41,28.89 59.51,29.98 59.51,30.11 CC3-EXT.MOSI
  Bottom 0.305: CC2-EXT.MOSI 43.05,36.05 36.77,42.33 U$1.26 | v27.93,22.42 27.27,23.09 25.95,23.09 25.56,22.7 CC0.MOSI | CC3-EXT.MOSI 60.58,29.05 60.71,29.05 61.64,28.11 61.64,27.51 62.94,26.21 v64.84,26.21
N$1
  Top 0.61: 48.13,20.2 46.51,21.83 45.35,21.83 43.84,23.34 CC2.VCC | VTRX2.2 48.13,20.2 | 48.13,20.2 89.53,20.2 93.04,23.71 93.04,26.07 C3.2
N$3  (via drill 0.3 pad 0.61)
  Top 0.61: CC3.VCC 69.25,26.06 69.28,26.1 C4.2 69.28,28.51 v69.09,28.51
  Bottom 0.61: VTRX3.2 67.82,29.39 68.22,29.39 v69.09,28.51
RST
  Top 0.305: U$1.17 41.85,32.35 41.39,31.89 20.91,31.89 17.15,28.14 10.72,28.14 7.75,31.11 IC2.3
RX1
  Top 0.305: UART1.3 58.23,39.37 62.74,34.85 72.03,34.85 72.28,35.11 84.71,35.11 85.69,36.09 HMMOD-UART.5
  Bottom 0.305: U$1.22 46.93,47.61 51.51,43.02 51.51,39.37 UART1.3
RX-MAPLE
  Top 0.305: U$1.30 26.61,47.61 47.4,47.61 48.2,48.41 48.2,50.46 48.99,51.25 49.9,51.25 51.51,49.64 51.51,49.53 UART0.3
RX_DBG  (via drill 0.3 pad 0.61)
  Top 0.305: WLAN.TX 59.27,40.49 50.46,40.49 48.09,38.12 34.9,38.12 v34.58,37.79 | DBG.4 95.07,48.26 v92.03,45.22
  Bottom 0.305: WLAN.TX 64.44,37.23 72.35,37.23 80.34,45.22 v92.03,45.22 | U$1.14 34.23,36.01 34.58,36.36 v34.58,37.79
SCK1  (via drill 0.3 pad 0.61)  (1 unrouted)
  Top 0.305: 60.22,23.85 62.47,21.59 86.11,21.59 88.01,23.5 CC1.SCLK | v29.49,22.76 29.55,22.7 37.05,22.7 37.84,23.5 CC2.SCLK 37.94,24.86 v38.81,24.86 | CC3.SCLK 63.24,26.04 62.53,26.04 61.48,27.08 60.58,27.08 | 60.58,27.08 60.58,26.51 60.22,26.15 60.22,23.85 | CC3-EXT.SCK 60.58,27.08 | 60.22,23.85 59.24,22.88 46.31,22.88 45.2,23.98 45.2,25.29 44.12,26.37 43.05,26.37 CC2-EXT.SCK
  Bottom 0.305: CC0.SCLK 26.98,21.28 27.48,21.79 28.52,21.79 v29.49,22.76 | 40.26,28.71 40.82,28.71 41.98,27.55 41.98,27.44 CC2-EXT.SCK | 40.26,28.71 39.44,29.53 39.44,31.07 37.88,32.63 37.88,36.24 29.44,44.67 29.44,45.47 31.58,47.61 31.69,47.61 U$1.28 | 40.26,28.71 39.24,27.69 39.24,25.28 v38.81,24.86
SCK2
  Top 0.305: U$1.19 45.1,36.01 41.35,36.01 40.58,35.24 40.58,33.16 39.76,32.35 20.68,32.35 16.92,28.59 12.78,28.59 10.29,31.08 IC2.4
TX1
  Top 0.305: UART1.2 60.08,36.83 62.52,34.4 72.21,34.4 72.47,34.65 86.26,34.65 87.69,36.09 HMMOD-UART.6
  Bottom 0.305: U$1.23 44.39,47.61 45.37,47.61 49.87,43.11 49.87,38.48 51.51,36.83 UART1.2
TX-MAPLE
  Top 0.305: U$1.31 26.5,46.99 UART0.2
TX_DBG  (via drill 0.3 pad 0.61)
  Top 0.305: DBG.3 95.96,45.72 95.91,45.66 v94.87,45.66 | v60.07,32.04 49.28,32.04 48.2,33.12 48.2,35.18 46.91,36.48 37.23,36.48 36.77,36.01 U$1.15
  Bottom 0.305: v60.07,32.04 60.74,31.36 63.69,31.36 64.03,31.7 64.03,32.95 62.52,34.46 62.52,36.72 63.65,37.85 69.19,37.85 70.15,38.81 WLAN.RX 72.06,38.81 79.11,45.85 94.68,45.85 v94.87,45.66
VCC  (via drill 0.3 pad 0.61)  (2 unrouted)
  Top 0.61: C12.1 71.91,33.02 72.75,33.86 79.64,33.86 80.01,33.49 80.01,28.79 | C5.+ 75.69,28.07 75.69,28.4 C7.2 80.01,28.4 80.01,28.79 | CC1.VCC 94.88,25.63 94.88,27.74 93.82,28.79 80.01,28.79 | 14.8,41.88 15.11,42.2 28.17,42.2 30.52,44.55 51.26,44.55 51.36,44.45 UART0.1 62.03,44.45 67.45,39.02 67.45,38.34 68.25,37.54 69.83,37.54 WLAN.VCC | U$1.1 3.37,36.34 9.26,36.34 14.8,41.88 | 5.02,48.15 5.82,47.35 9.33,47.35 14.8,41.88 | 5.02,48.15 5.02,51.75 IC2.11 IC2.10 7.75,54.66 7.04,54.66 6.67,55.04 C6.1 | U$1.40 3.22,47.41 4.27,47.41 5.02,48.15 | DBG.2 95.81,43.18 95.56,43.43 v94.75,43.43 | VTRX2.1 v47.12,20.14 | C2.2 47.12,25.15 46.66,25.15 45.59,26.22 CC2-EXT.VCC@1 | CC3-EXT.VCC@0 61.9,30.11 61.9,31.33 58.94,34.29 UART1.1
  Bottom 0.61: 66.8,30.75 64.97,30.75 64.33,30.11 CC3-EXT.VCC@0 63.12,28.79 CC3-EXT.VCC@1 | VTRX3.1 66.8,30.75 | 66.8,30.75 66.8,30.81 66.8,31.57 70.33,31.57 | 70.33,31.57 70.33,31.4 C5.+ | 70.33,31.57 70.33,35.49 WLAN.VCC 71.31,36.48 75.82,36.48 HMMOD-UART.1 77.69,39.47 90.79,39.47 v94.75,43.43 | v47.12,20.14 47.12,24.69 45.59,26.22 CC2-EXT.VCC@1 CC2-EXT.VCC@0 49.03,29.98 UART1.1 | 21.93,26.33 22.7,26.33 C1.2 | 21.93,26.33 21.62,26.64 | CC0.VCC 21.93,26.33 | U$1.1 1.21,29.8 4.37,26.64 21.62,26.64 | 21.62,26.64
VIN
  Top 0.61: U$3.TIP 91.58,32.16 95.65,28.08 95.65,24.31 89.3,17.96 31.32,17.96 25.96,23.32 21.95,23.32 20.39,21.76 20.39,21.21 F1.P$2 17.45,21.21 17.42,21.18 U$2.TIP
VIN2  (via drill 0.3 pad 0.61)
  Top 0.61: IC1.4 28.04,14.22 28.14,14.33 v32.64,14.33 | U$1.21 50.63,48.26 87.89,48.26 95.51,40.64 DBG.1 | 20.13,14.22 IC1.4 | IC6.2 20.13,14.22 | 20.13,14.22 20.13,10.57 18.96,9.4 NO_REGULATOR.1 | IC6.TAB IC1.4
  Bottom 0.61: U$1.21 47.45,51.44 43.89,51.44 43.17,50.72 43.17,41.04 45.65,38.56 45.65,32.73 44.27,31.35 44.27,25.96 v32.64,14.33
WIZ_CS
  Top 0.305: U$1.20 49.47,36.01 48.54,36.93 36.1,36.93 35.57,36.4 21.47,36.4 20.26,35.19 20.26,33.15 16.16,29.06 14.91,29.06 12.83,31.14 IC2.5
WIZ_RST  (via drill 0.3 pad 0.61)
  Top 0.305: v30.05,45.15 18.44,45.15 15.34,48.26 15.34,50.24 13.64,51.94 IC2.8
  Bottom 0.305: U$1.16 39.31,36.01 39.19,36.01 v30.05,45.15

### Text on the board
tNames: MAPLE CUN / - large - | GND | CS | VCC | GND | T | GND | R | R | VCC | T | + | GND | VIN | TX | TX | RX | RX | 31 | VCC | LAN | CC3 | Ant0 | Ant2 | Ant3 | Ant1
bNames: Socket CC1101 / Transc. 2+3 | Version 3.3 / www.neuby.de | MAPLE CUN | Ant0 | Ant2 | Ant3 | Ant1